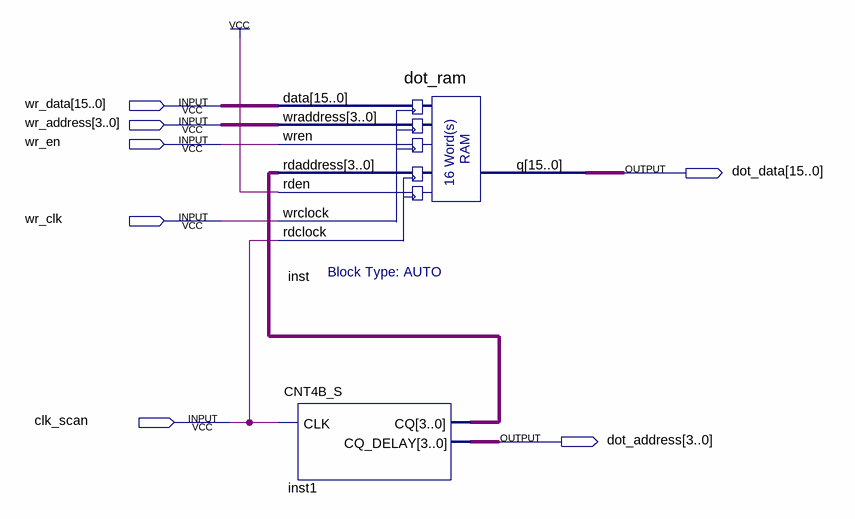
[diagram p0: schematic sheet]
// Quartus schematic dot_buffer.bdf as structural Verilog: 2 symbols, 7 pins
module dot_buffer (
  input  [15:0] wr_data,
  input  [3:0] wr_address,
  input  wr_en,
  input  wr_clk,
  input  clk_scan,
  output [15:0] dot_data,
  output [3:0] dot_address
);

  wire [3:0] inst1_cq;

  dot_ram inst (
    .data(wr_data), .wraddress(wr_address), .wren(wr_en), .rdaddress(inst1_cq), .rden(1'b1),
    .wrclock(wr_clk), .rdclock(clk_scan), .q(dot_data));
  CNT4B_S inst1 (.CLK(clk_scan), .CQ(inst1_cq), .CQ_DELAY(dot_address));
endmodule
